# EAGLE design PCB_Design.sch (EAGLE 9.6.2)
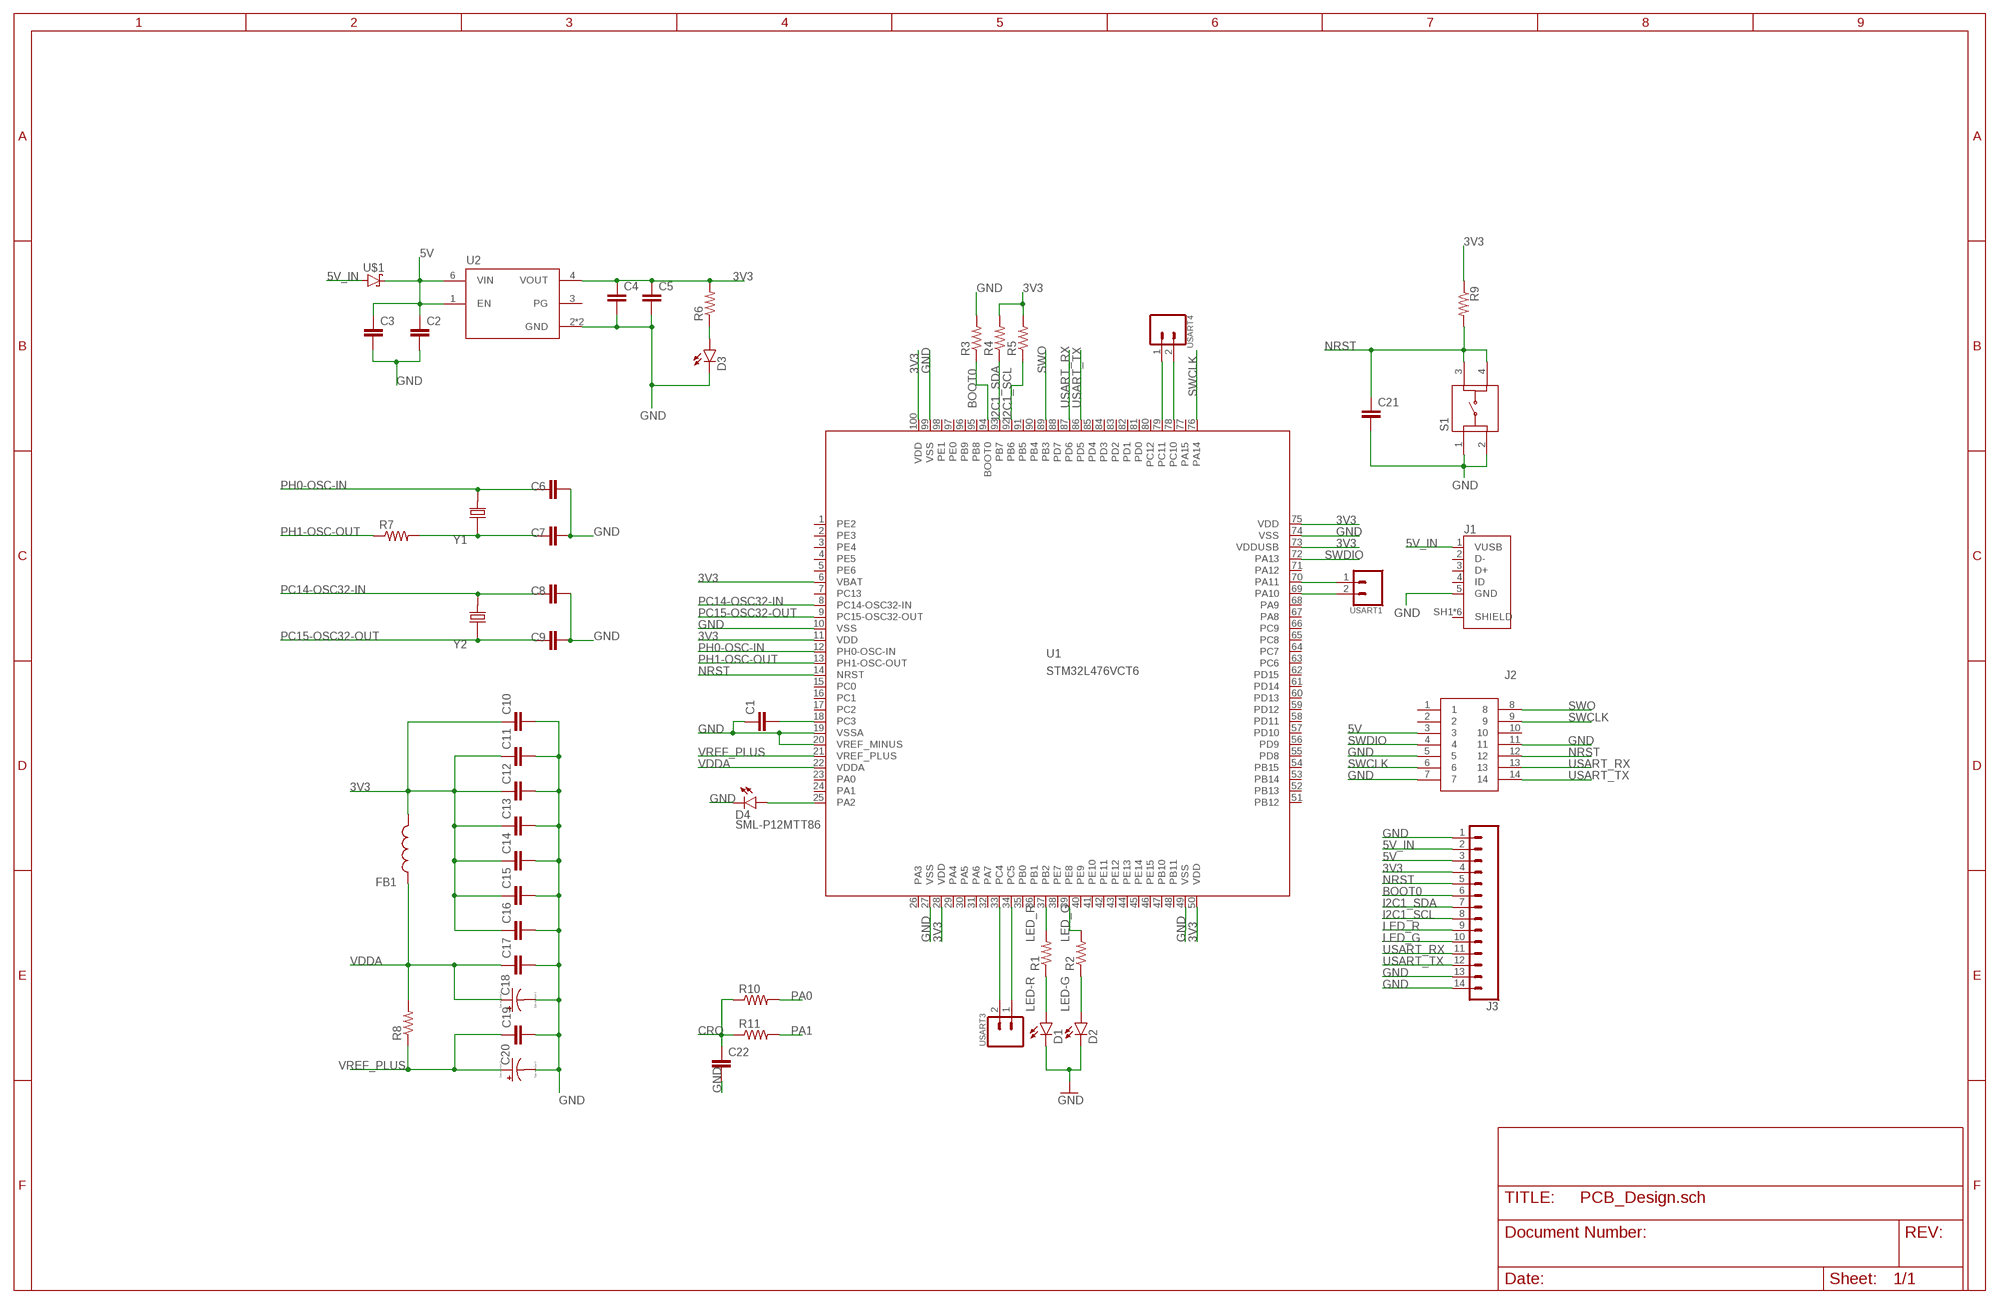
[diagram p0: schematic, sheet 1]

## Parts
C1  CC0603KRX5R7BB105  [CAPC1608X90]
C2  CC0603KRX5R7BB105  [CAPC1608X90]
C3  CC0603KRX5R7BB105  [CAPC1608X90]
C4  CC0603KRX5R7BB105  [CAPC1608X90]
C5  CC0603KRX5R7BB105  [CAPC1608X90]
C6  CC0402JRNPO9BN200  [CAPC1005X55N]
C7  CC0402JRNPO9BN200  [CAPC1005X55N]
C8  CC0402CRNPO9BN4R7  [CAPC1005X55N]
C9  CC0402CRNPO9BN4R7  [CAPC1005X55N]
C10  CC0603KRX5R7BB105  [CAPC1608X90]
C11  CC0402KRX7R7BB104  [CAPC1005X55N]
C12  CC0402KRX7R7BB104  [CAPC1005X55N]
C13  CC0402KRX7R7BB104  [CAPC1005X55N]
C14  CC0402KRX7R7BB104  [CAPC1005X55N]
C15  CC0402KRX7R7BB104  [CAPC1005X55N]
C16  CC0402KRX7R7BB104  [CAPC1005X55N]
C17  CC0402KRX7R7BB104  [CAPC1005X55N]
C18  TAJA105K016RNJ  [CAPPM3216X180N]
C19  CC0402KRX7R7BB104  [CAPC1005X55N]
C20  TAJA105K016RNJ  [CAPPM3216X180N]
C21  CC0402KRX7R7BB104  [CAPC1005X55N]
C22  CC0402KRX7R7BB104  [CAPC1005X55N]
D1  SML-P12MTT86  [LED_SML-P11UTT86R]
D2  SML-P12MTT86  [LED_SML-P11UTT86R]
D3  SML-P12VTT86  [LED_SML-P11UTT86R]
D4  SML-P12MTT86  [LED_SML-P11UTT86R]
FB1  BK1608HS601-T  [BEADC1608X95N]
J1  10118192-0001LF  [AMPHENOL_10118192-0001LF]
J2  FTSH-107-01-L-DV-K-A  [FTSH10701LDVKA]
J3  CONN_14  [1X14]
R1  RC0402FR-071KL  [RESC1005X40N]
R2  RC0402FR-071KL  [RESC1005X40N]
R3  RC0402FR-071KL  [RESC1005X40N]
R4  RC0402FR-071KL  [RESC1005X40N]
R5  RC0402FR-071KL  [RESC1005X40N]
R6  RC0402FR-071KL  [RESC1005X40N]
R7  RC0402FR-071KL  [RESC1005X40N]
R8  RC0402FR-071KL  [RESC1005X40N]
R9  RC0402FR-071KL  [RESC1005X40N]
R10  RC0402FR-0710KL  [RESC1005X40N]
R11  RC0402FR-07330RL  [RESC1005X40N]
S1  LL3301FF065QJ  [LL3301FF065QJ]
U1  STM32L476VCT6  [LQFP100_14X14]
U2  LD39050PU33R  [SON95P300X300X100-7N]
U$1  STPS1L30A  [DIOM5226X223N]
USART1  CONN_02LOCK  [1X02_LOCK]
USART3  CONN_02LOCK  [1X02_LOCK]
USART4  CONN_02LOCK  [1X02_LOCK]
Y1  ABLS-8.000MHZ-B2-T  [XTAL_ABLS-8.000MHZ-B2-T]
Y2  ECS-.327-12.5-12QS-TR  [XTAL_ECS-.327-12.5-12QS-TR]

## Nets
3V3: C4.1 C5.1 C10.1 C11.1 C12.1 C13.1 C14.1 C15.1 C16.1 FB1.2 J3.4 R4.2 R5.2 R6.2 R9.1 U1.6(VBAT) U1.11(VDD) U1.28(VDD) U1.50(VDD) U1.73(VDDUSB) U1.75(VDD) U1.100(VDD) U2.4(VOUT)
5V: C2.1 C3.1 J2.3 J3.3 U2.1(EN) U2.6(VIN) U$1.1(C)
5V_IN: J1.1(VUSB) J3.2 U$1.2(A)
BOOT0: J3.6 R3.1 U1.94(BOOT0)
CRO: C22.1 R10.1 R11.1
GND: C1.1 C2.2 C3.2 C4.2 C5.2 C6.2 C7.2 C8.2 C9.2 C10.2 C11.2 C12.2 C13.2 C14.2 C15.2 C16.2 C17.2 C18.C(-) C19.2 C20.C(-) C21.2 C22.2 D1.C D2.C D3.C D4.C J1.5(GND) J2.5 J2.7 J2.11 J3.1 J3.13 J3.14 R3.2 S1.1 S1.2 U1.10(VSS) U1.19(VSSA) U1.20(VREF_MINUS) U1.27(VSS) U1.49(VSS) U1.74(VSS) U1.99(VSS) U2.2(GND) U2.7(GND)
I2C1_SCL: J3.8 R5.1 U1.92(PB6)
I2C1_SDA: J3.7 R4.1 U1.93(PB7)
LED-G: D2.A R2.1
LED-R: D1.A R1.1
LED_G: J3.10 R2.2 U1.39(PE8)
LED_R: J3.9 R1.2 U1.37(PB2)
N$1: D4.A U1.25(PA2)
N$2: U1.33(PC4) USART3.2
N$3: U1.34(PC5) USART3.1
N$4: U1.78(PC10) USART4.2
N$5: U1.69(PA10) USART1.2
N$6: U1.79(PC11) USART4.1
N$7: U1.70(PA11) USART1.1
N$9: C7.1 R7.2 Y1.1
N$11: C1.2 U1.18(PC3)
N$14: D3.A R6.1
NRST: C21.1 J2.12 J3.5 R9.2 S1.3 S1.4 U1.14(NRST)
PA0: R10.2
PA1: R11.2
PC14-OSC32-IN: C8.1 U1.8(PC14-OSC32-IN) Y2.2
PC15-OSC32-OUT: C9.1 U1.9(PC15-OSC32-OUT) Y2.1
PH0-OSC-IN: C6.1 U1.12(PH0-OSC-IN) Y1.2
PH1-OSC-OUT: R7.1 U1.13(PH1-OSC-OUT)
SWCLK: J2.6 J2.9 U1.76(PA14)
SWDIO: J2.4 U1.72(PA13)
SWO: J2.8 U1.89(PB3)
USART_RX: J2.13 J3.11 U1.87(PD6)
USART_TX: J2.14 J3.12 U1.86(PD5)
VDDA: C17.1 C18.A(+) FB1.1 R8.2 U1.22(VDDA)
VREF_PLUS: C19.1 C20.A(+) R8.1 U1.21(VREF_PLUS)
Unconnected: J1.2(D-) J1.3(D+) J1.4(ID) J1.SH1(SHIELD) J1.SH2(SHIELD) J1.SH3(SHIELD) J1.SH4(SHIELD) J1.SH5(SHIELD) J1.SH6(SHIELD) J2.1 J2.2 J2.10 U1.1(PE2) U1.2(PE3) U1.3(PE4) U1.4(PE5) U1.5(PE6) U1.7(PC13) U1.15(PC0) U1.16(PC1) U1.17(PC2) U1.23(PA0) U1.24(PA1) U1.26(PA3) U1.29(PA4) U1.30(PA5) U1.31(PA6) U1.32(PA7) U1.35(PB0) U1.36(PB1) U1.38(PE7) U1.40(PE9) U1.41(PE10) U1.42(PE11) U1.43(PE12) U1.44(PE13) U1.45(PE14) U1.46(PE15) U1.47(PB10) U1.48(PB11) U1.51(PB12) U1.52(PB13) U1.53(PB14) U1.54(PB15) U1.55(PD8) U1.56(PD9) U1.57(PD10) U1.58(PD11) U1.59(PD12) U1.60(PD13) U1.61(PD14) U1.62(PD15) U1.63(PC6) U1.64(PC7) U1.65(PC8) U1.66(PC9) U1.67(PA8) U1.68(PA9) U1.71(PA12) U1.77(PA15) U1.80(PC12) U1.81(PD0) U1.82(PD1) U1.83(PD2) U1.84(PD3) U1.85(PD4) U1.88(PD7) U1.90(PB4) U1.91(PB5) U1.95(PB8) U1.96(PB9) U1.97(PE0) U1.98(PE1) U2.3(PG)

## Library data of the parts
C1-C5 C10 = ce-capstone:CC0603KRX5R7BB105: CAPACITOR CERAMIC, 1µF, 10V, X5R, 0603; Dielectric Characteristic:X5R; Capacitance:1µF; Capacitance Tolerance:± 10%; Voltage Rating:16V; Temperature Coefficient:± 15%; Capacitor Case Style:0603; No. of Pins:2; Mounting Type:SMD ;RoHS Compliant: Yes; DESCRIPTION: 1µF ±10% 16V Ceramic Capacitor X5R 0603 _1608 Metric_; DIGI-KEY_PART_NUMBER: 311-1444-1-ND; DIGI-KEY_PURCHASE_URL: https://www.digikey.com/product-detail/en/yageo/CC0603KRX5R7BB105/311-1444-1-ND/2833750?utm_source=snapeda&utm_medium=aggregator&utm_campaign=symbol; MF: Yageo; MP: CC0603KRX5R7BB105; PACKAGE: 0603 Yageo
C6 C7 = ce-capstone:CC0402JRNPO9BN200: CAPACITOR CERAMIC 20PF 50V, C0G, 0402; Dielectric Characteristic:C0G / NP0; Capacitance:20pF; Capacitance Tolerance:± 5%; Voltage Rating:50V; Capacitor Case Style:0402; Capacitor Mounting:SMD; DESCRIPTION: 20pF ±5% 50V Ceramic Capacitor C0G, NP0 0402 _1005 Metric_; DIGI-KEY_PART_NUMBER: 311-1417-1-ND; DIGI-KEY_PURCHASE_URL: https://www.digikey.com/product-detail/en/yageo/CC0402JRNPO9BN200/311-1417-1-ND/2833723?utm_source=snapeda&utm_medium=aggregator&utm_campaign=symbol; MF: Yageo; MP: CC0402JRNPO9BN200; PACKAGE: 0402 Yageo
C8 C9 = ce-capstone:CC0402CRNPO9BN4R7: 0402 4.7 pF 50 V ±0.25 pF Tolerance NP0 SMT Multilayer Ceramic Capacitor; DESCRIPTION: 4.7pF ±0.25pF 50V Ceramic Capacitor C0G, NP0 0402 _1005 Metric_; DIGI-KEY_PART_NUMBER: 311-1367-1-ND; DIGI-KEY_PURCHASE_URL: https://www.digikey.com/product-detail/en/yageo/CC0402CRNPO9BN4R7/311-1367-1-ND/2103151?utm_source=snapeda&utm_medium=aggregator&utm_campaign=symbol; MF: Yageo; MP: CC0402CRNPO9BN4R7; PACKAGE: 0402 Yageo
C11-C17 C19 C21 C22 = ce-capstone:CC0402KRX7R7BB104: .1UF 16V 10% 0402; DESCRIPTION: 0.1µF ±10% 16V Ceramic Capacitor X7R 0402 _1005 Metric_; DIGI-KEY_PART_NUMBER: 311-1338-1-ND; DIGI-KEY_PURCHASE_URL: https://www.digikey.com/product-detail/en/yageo/CC0402KRX7R7BB104/311-1338-1-ND/2103122?utm_source=snapeda&utm_medium=aggregator&utm_campaign=symbol; MF: Yageo; MP: CC0402KRX7R7BB104; PACKAGE: 0402 Yageo
C18 C20 = ce-capstone:TAJA105K016RNJ: Capacitor tantalum TAJ 1206 1uF 16V AVX 1uF SMD Solid MnO2 Tantalum Electrolytic Capacitor, 16 V dc +/-10%, TAJ Series Source: Datasheet; ALLIED_NUMBER: 70474975; ALLIED_PRICE-STOCK: https://www.alliedelec.com/avx-taja105k016r/70474975/; DESCRIPTION: Capacitor tantalum TAJ 1206 1uF 16V AVX 1uF SMD Solid MnO2 Tantalum Electrolytic Capacitor, 16 V dc +/-10%, TAJ Series; HEIGHT: 1.8mm; MANUFACTURER_NAME: AVX; MANUFACTURER_PART_NUMBER: TAJA105K016RNJ; MOUSER_PART_NUMBER: 581-TAJA105K016RNJ; MOUSER_PRICE-STOCK: https://www.mouser.com/Search/Refine.aspx?Keyword=581-TAJA105K016R; RS_PART_NUMBER: 6992804P; RS_PRICE-STOCK: http://uk.rs-online.com/web/p/products/6992804P
D1 D2 D4 = ce-capstone:SML-P12MTT86: SML-P1 Series Red 0402 Clear 60 mcd 2 V Surface Mount PICOLED LED; AVAILABILITY: Unavailable; DESCRIPTION: Green 572nm LED Indication - Discrete 2V 0402 _1006 Metric_; MF: Rohm; MP: SML-P12MTT86; PACKAGE: 0402 Rohm; PRICE: None
D3 = ce-capstone:SML-P12VTT86: SML-P1 Series Red 0402 Clear 60 mcd 2 V Surface Mount PICOLED LED; AVAILABILITY: Unavailable; DESCRIPTION: Red 630nm LED Indication - Discrete 2V 0402 _1006 Metric_; MF: Rohm; MP: SML-P12VTT86; PACKAGE: 0402 Rohm; PRICE: None
FB1 = ce-capstone:BK1608HS601-T: Ferrite Chip Bead(Lead Free) Source: Datasheet; DESCRIPTION: Ferrite Chip Bead(Lead Free); HEIGHT: 0.95mm; MANUFACTURER_NAME: Taiyo Yuden; MANUFACTURER_PART_NUMBER: BK1608HS601-T
J1 = ce-capstone:10118192-0001LF: Single Port 5 Contact Horizontal Right Angle Shielded Micro B USB 2.0 Connector; AVAILABILITY: Unavailable; DESCRIPTION: USB - micro B USB 2.0 Receptacle Connector 5 Position Surface Mount, Right Angle; MF: Amphenol ICC; MP: 10118192-0001LF; PACKAGE: None; PRICE: None
J2 = ce-capstone:FTSH-107-01-L-DV-K-A: Headers & Wire Housings .050" Micro Terminal Strip Source: Datasheet; DESCRIPTION: Headers & Wire Housings .050" Micro Terminal Strip; HEIGHT: 5.97mm; MANUFACTURER_NAME: SAMTEC; MANUFACTURER_PART_NUMBER: FTSH-107-01-L-DV-K-A; MOUSER_PART_NUMBER: 200-FTSH10701LDVKA; MOUSER_PRICE-STOCK: https://www.mouser.com/Search/Refine.aspx?Keyword=200-FTSH10701LDVKA
J3 = SparkFun-Connectors:CONN_14: Multi connection point. Often used as Generic Header-pin footprint for 0.1 inch spaced/style header connections On any of the 0.1 inch spaced packages, you can populate with these: Break Away Headers - Straight (PRT-00116) Break Away Male Headers - Right Angle (PRT-00553) Female Headers (PRT-00115) Break Away Headers - Machine Pin (PRT-00117) Break Away Female Headers - Swiss Machine Pin (PRT-00743) For SCREWTERMINALS and SPRING TERMINALS visit here: Screw Terimnals on SparkFun.com (5mm/3.5mm/2.54mm spacing) This device is also useful as a general connection point to wire up your design to another part of your project. Our various solder wires solder well into these plated through hole pads. Hook-Up Wire - Assortment (Stranded, 22 AWG) (PRT-11375) Hook-Up Wire - Assortment (Solid Core, 22 AWG) (PRT-11367) View the entire wire category on our website here Special notes: Molex polarized connector foot print use with SKU : PRT-08231 with associated crimp pins and housings. 1MM SMD Version SKU: PRT-10208 NOTES ON THE VARIANTS LOCK and LOCK_LONGPADS... This footprint was designed to help hold the alignment of a through-hole component (i.e. 6-pin header) while soldering it into place. You may notice that each hole has been shifted either up or down by 0.005 of an inch from it's more standard position (which is a perfectly straight line). This slight alteration caused the pins (the squares in the middle) to touch the edges of the holes. Because they are alternating, it causes a "brace" to hold the component in place. 0.005 has proven to be the perfect amount of "off-center" position when using our standard breakaway headers. Although looks a little odd when you look at the bare footprint, once you have a header in there, the alteration is very hard to notice. Also,if you push a header all the way into place, it is covered up entirely on the bottom side.
R1-R9 = ce-capstone:RC0402FR-071KL: RES SMD 1k OHM 1% 1/16W 0402; DESCRIPTION: 510 Ohms ±1% 0.063W, 1/16W Chip Resistor 0402 _1005 Metric_ Moisture Resistant Thick Film; DIGI-KEY_PART_NUMBER: 311-510LRCT-ND; DIGI-KEY_PURCHASE_URL: https://www.digikey.com/product-detail/en/yageo/RC0402FR-07510RL/311-510LRCT-ND/729579?utm_source=snapeda&utm_medium=aggregator&utm_campaign=symbol; MF: Yageo; MP: RC0402FR-07510RL; PACKAGE: 1005 Panasonic Electronic Components
R10 = ce-capstone:RC0402FR-0710KL: RES SMD 10k OHM 1% 1/16W 0402; DESCRIPTION: 510 Ohms ±1% 0.063W, 1/16W Chip Resistor 0402 _1005 Metric_ Moisture Resistant Thick Film; DIGI-KEY_PART_NUMBER: 311-510LRCT-ND; DIGI-KEY_PURCHASE_URL: https://www.digikey.com/product-detail/en/yageo/RC0402FR-07510RL/311-510LRCT-ND/729579?utm_source=snapeda&utm_medium=aggregator&utm_campaign=symbol; MF: Yageo; MP: RC0402FR-07510RL; PACKAGE: 1005 Panasonic Electronic Components
R11 = ce-capstone:RC0402FR-07330RL: RES SMD 330 OHM 1% 1/16W 0402; DESCRIPTION: 510 Ohms ±1% 0.063W, 1/16W Chip Resistor 0402 _1005 Metric_ Moisture Resistant Thick Film; DIGI-KEY_PART_NUMBER: 311-510LRCT-ND; DIGI-KEY_PURCHASE_URL: https://www.digikey.com/product-detail/en/yageo/RC0402FR-07510RL/311-510LRCT-ND/729579?utm_source=snapeda&utm_medium=aggregator&utm_campaign=symbol; MF: Yageo; MP: RC0402FR-07510RL; PACKAGE: 1005 Panasonic Electronic Components
S1 = ce-capstone:LL3301FF065QJ: Pushbutton Switches 50mA 12VDC F065 7.0mm J-Lead Source: Datasheet; DESCRIPTION: Pushbutton Switches 50mA 12VDC F065 7.0mm J-Lead; HEIGHT: 7.3mm; MANUFACTURER_NAME: E-Switch; MANUFACTURER_PART_NUMBER: LL3301FF065QJ; MOUSER_PART_NUMBER: 612-LL3301FF065QJ; MOUSER_PRICE-STOCK: https://www.mouser.com/Search/Refine.aspx?Keyword=612-LL3301FF065QJ
U1 = ce-capstone:STM32L476V*: STM32L476VX LQFP100 Datasheet STM32L476XX; FARNELL: 2518171; FLASH: 256kB; SRAM: 128kB
U2 = ce-capstone:LD39050PU33R: LD39050 Series 500 mA 3.3 V Fixed Low Noise LDO Voltage Regulator - DFN-6; AVAILABILITY: Unavailable; DESCRIPTION: Linear Voltage Regulator IC 1 Output 500mA 6-DFN _3x3_; MF: STMicroelectronics; MP: LD39050PU33R; PACKAGE: DFN-6 STMicroelectronics; PRICE: None
U$1 = ce-capstone:STPS1L30A
USART1 USART3 USART4 = SparkFun-Connectors:CONN_02: Multi connection point. Often used as Generic Header-pin footprint for 0.1 inch spaced/style header connections On any of the 0.1 inch spaced packages, you can populate with these: Break Away Headers - Straight (PRT-00116) Break Away Male Headers - Right Angle (PRT-00553) Female Headers (PRT-00115) Break Away Headers - Machine Pin (PRT-00117) Break Away Female Headers - Swiss Machine Pin (PRT-00743) For SCREWTERMINALS and SPRING TERMINALS visit here: Screw Terimnals on SparkFun.com (5mm/3.5mm/2.54mm spacing) This device is also useful as a general connection point to wire up your design to another part of your project. Our various solder wires solder well into these plated through hole pads. Hook-Up Wire - Assortment (Stranded, 22 AWG) (PRT-11375) Hook-Up Wire - Assortment (Solid Core, 22 AWG) (PRT-11367) View the entire wire category on our website here Special notes: Molex polarized connector foot print use with: PRT-08233 with associated crimp pins and housings. 2.54_SCREWTERM for use with PRT-10571. 3.5mm Screw Terminal footprints for PRT-08084 5mm Screw Terminal footprints for use with PRT-08432
Y1 = ce-capstone:ABLS-8.000MHZ-B2-T: Crystal 8MHz Â±20ppm (Tol) Â±50ppm (Stability) 18pF FUND 80Ohm 2-Pin HC-49/US SMD T/R; AVAILABILITY: Unavailable; DESCRIPTION: 8MHz ±20ppm Crystal 18pF 80 Ohms HC-49/US; MF: Abracon LLC; MP: ABLS-8.000MHZ-B2; PACKAGE: HC-49/US Abracon LLC; PRICE: None
Y2 = ce-capstone:ECS-.327-12.5-12QS-TR: SMD CRYSTAL 32.768 KHz; AVAILABILITY: Unavailable; DESCRIPTION: 32.768kHz ±20ppm Crystal 12.5pF 90 kOhms 2-SMD, No Lead; MF: ECS Inc.; MP: ECS-.327-12.5-12QS-TR; PACKAGE: SMD-2 ECS International; PRICE: None

## Board
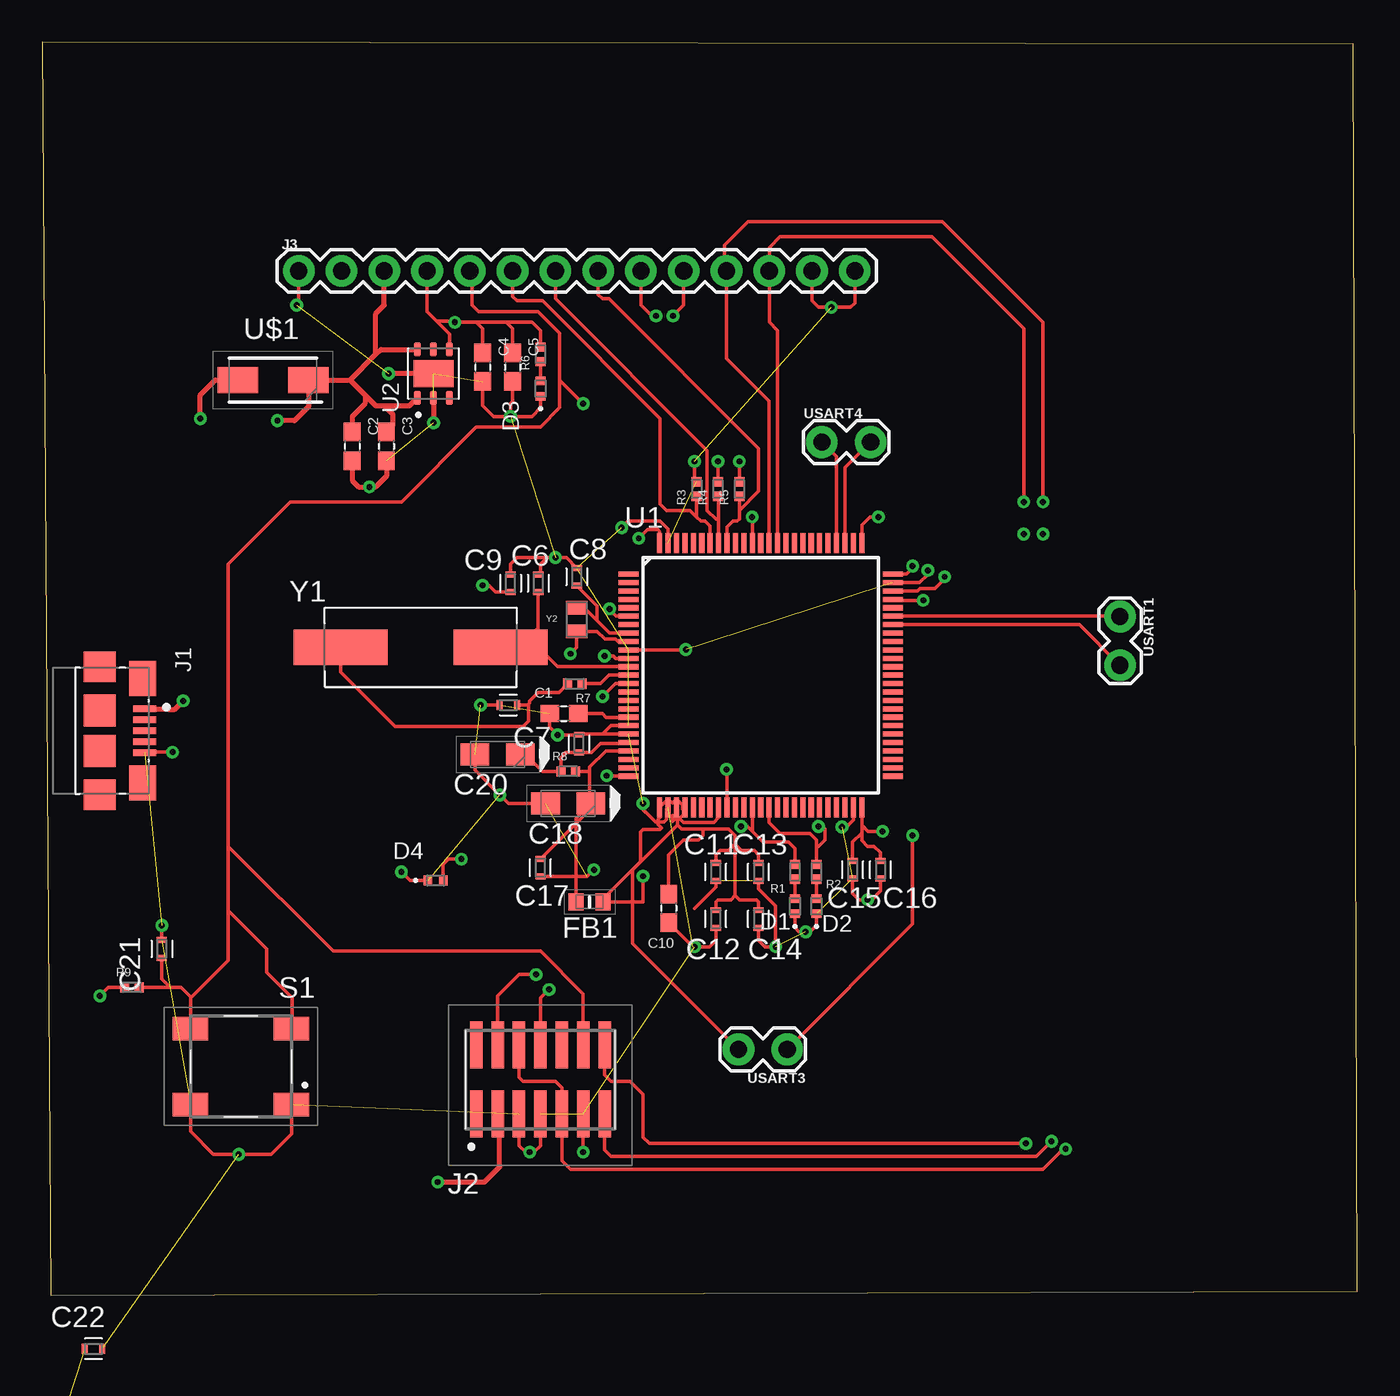
[diagram p1: board, top side]
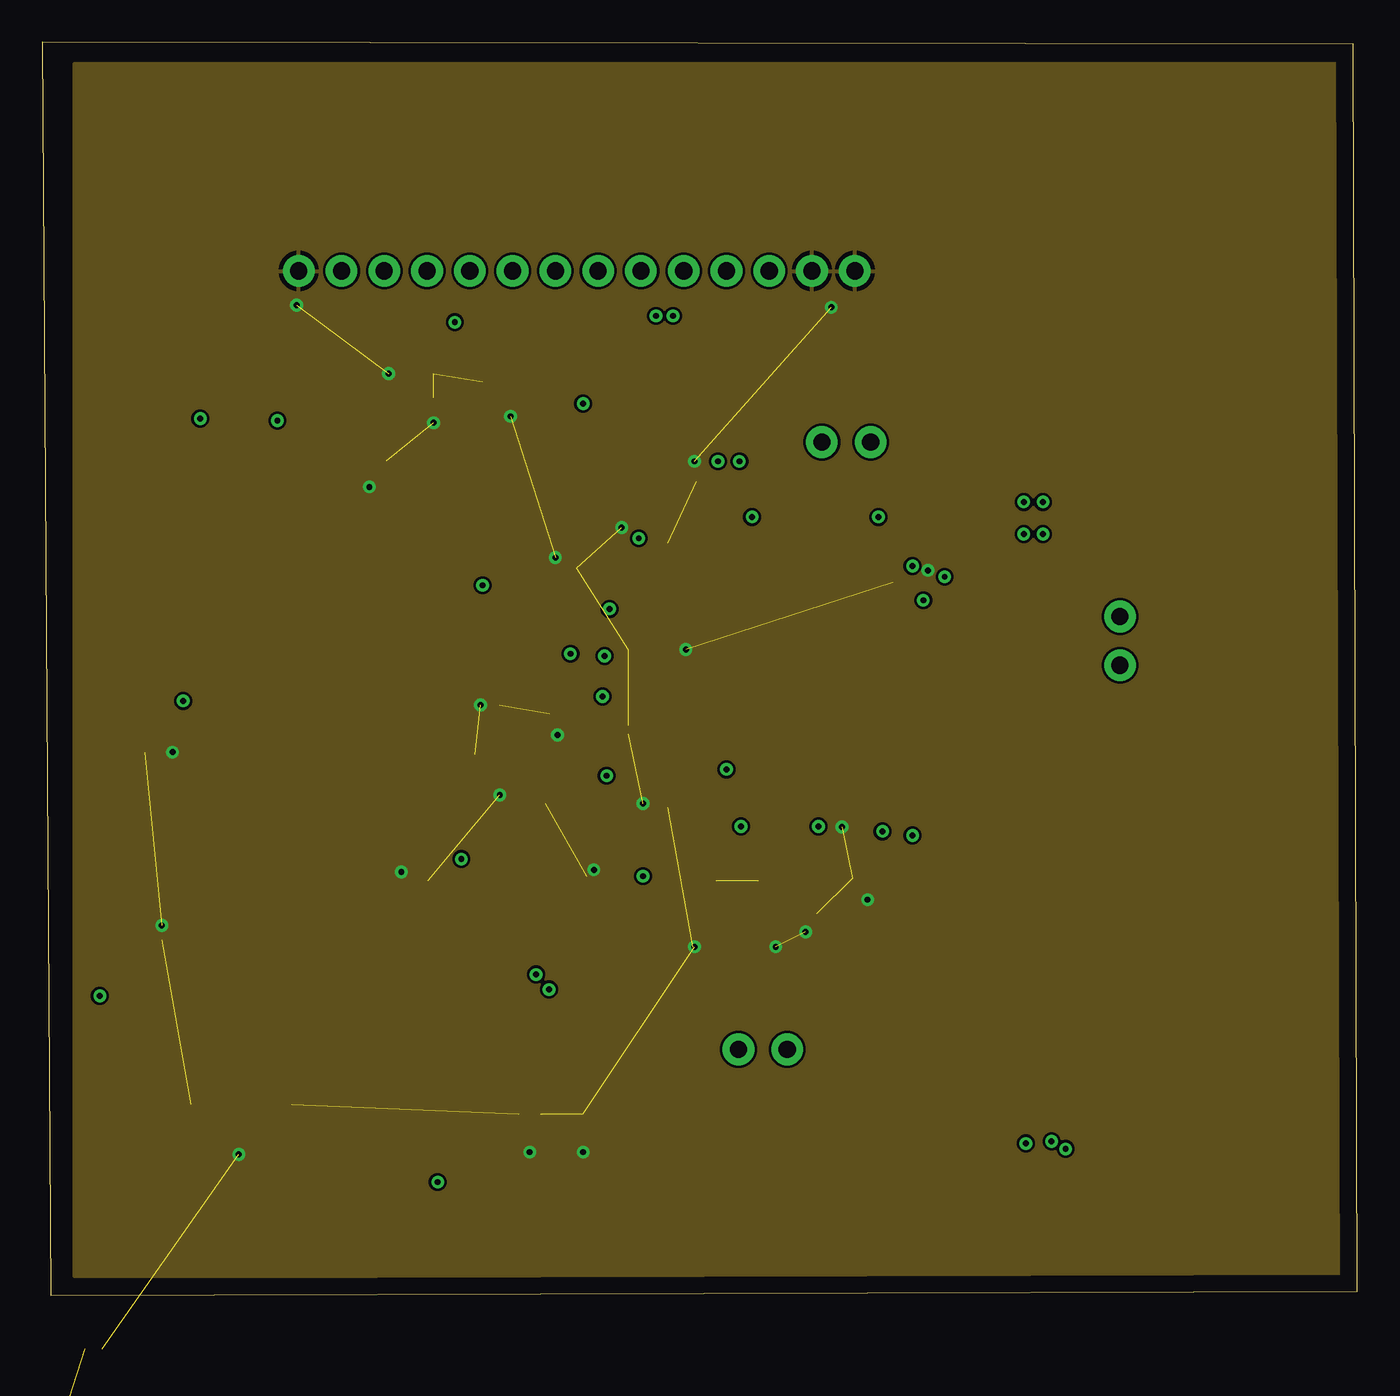
[diagram p2: board, inner layer Route2]
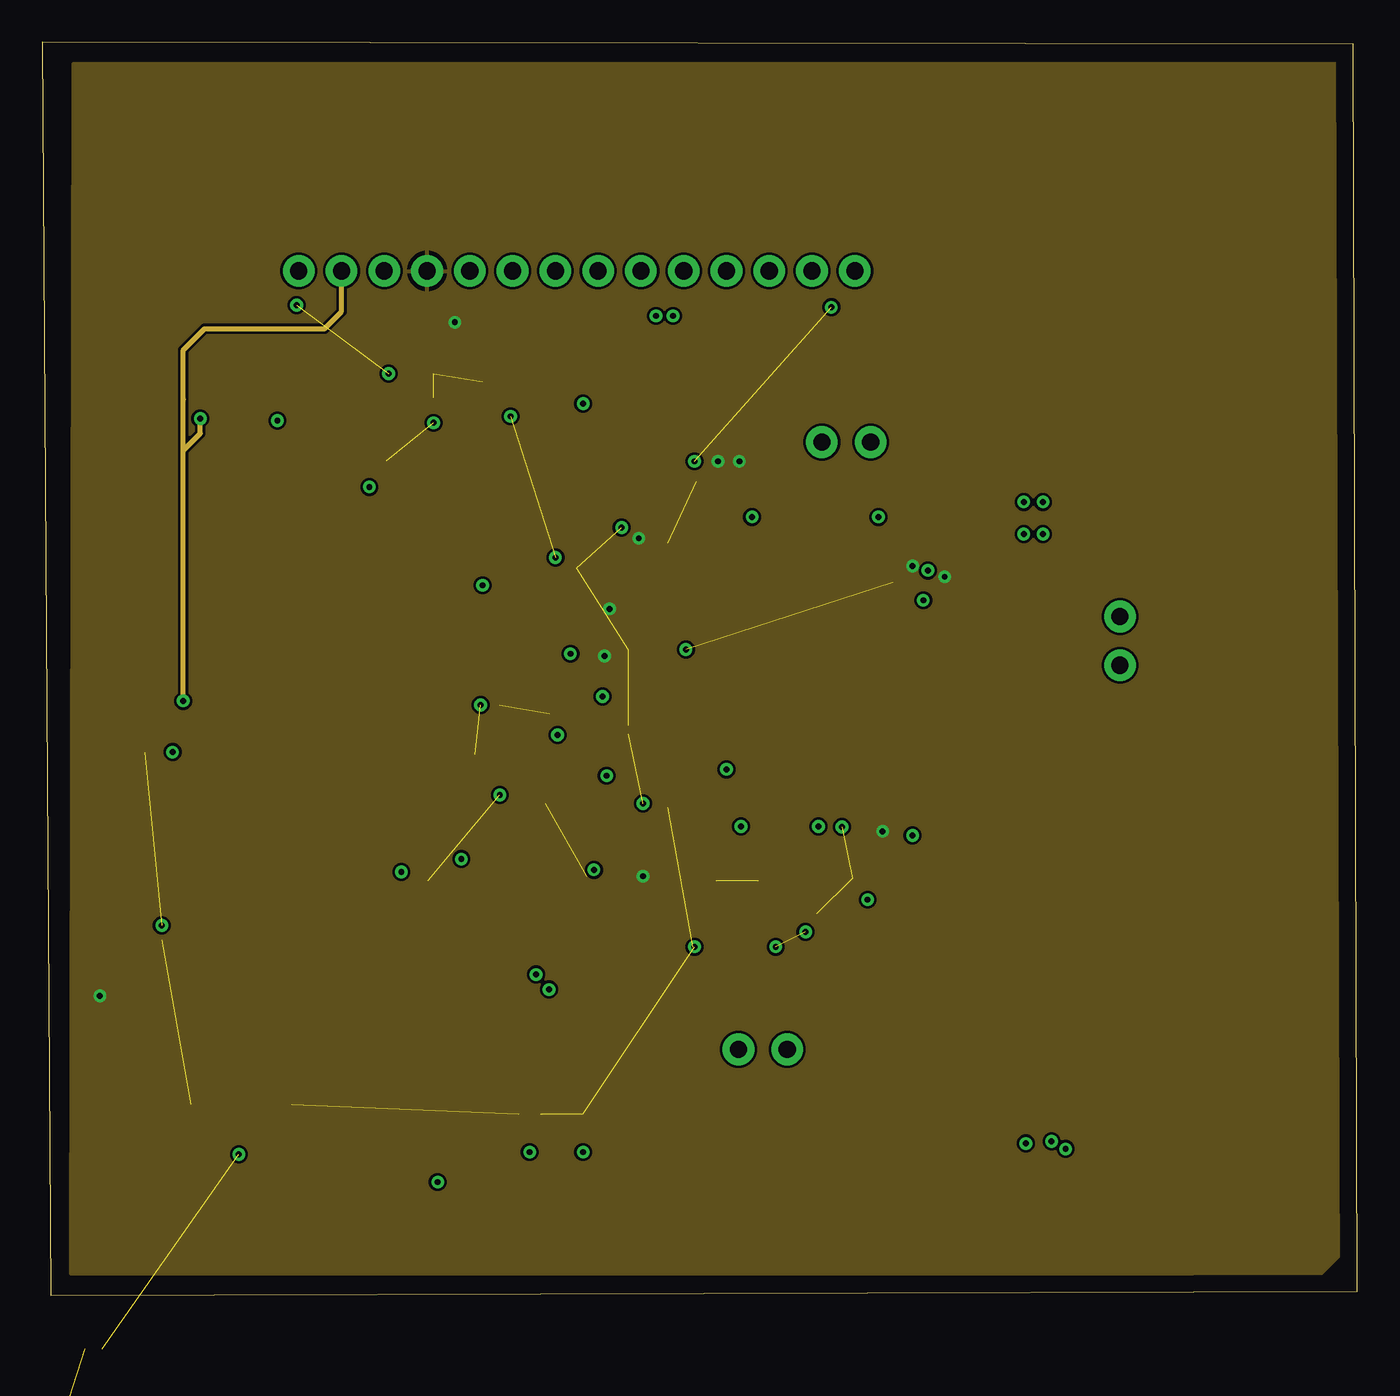
[diagram p3: board, inner layer Route15]
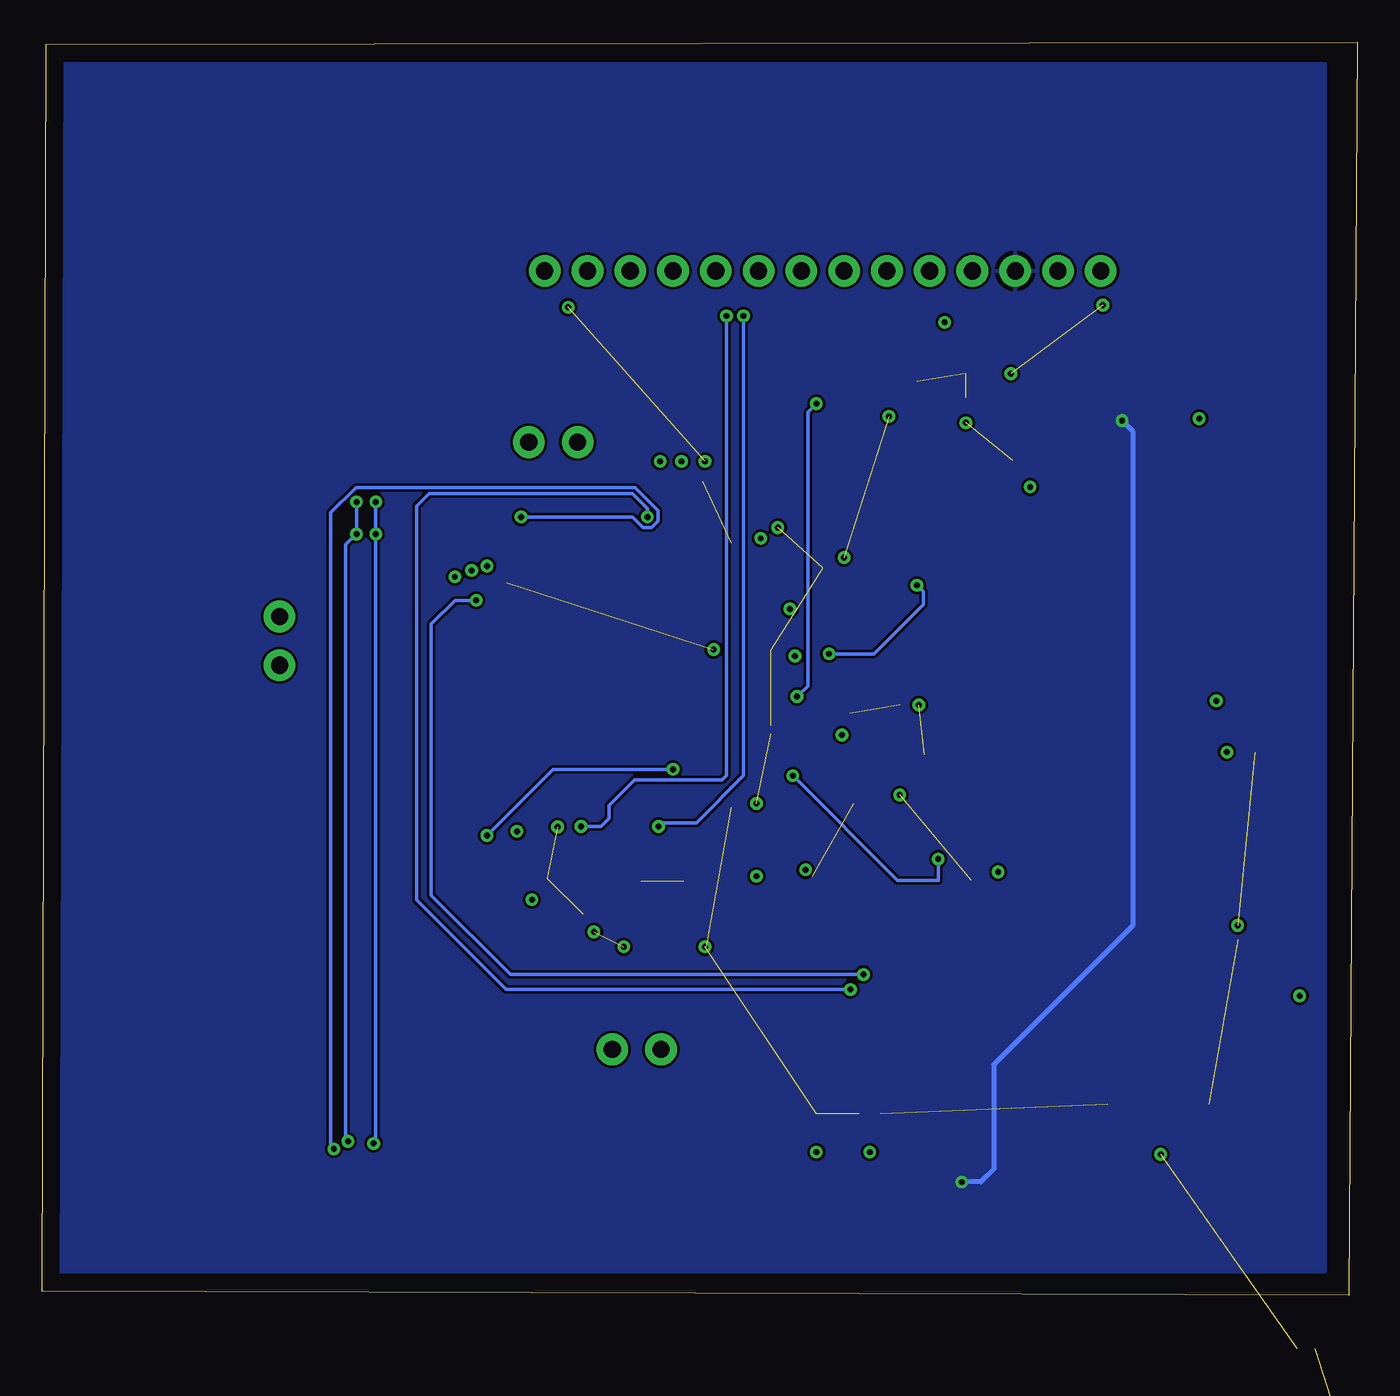
[diagram p4: board, bottom side, seen from below]

Size 78.11 x 74.42 mm. Coordinates in mm from the lower left corner, seen from the top.
Outline: 0.51,0 78.11,0.25 77.85,74.29 0,74.42 0.51,0
Copper layers (1+2*15+16): Top 0.035mm / dielectric 1.5mm / Route2 0.035mm / dielectric 0.15mm / Route15 0.035mm / dielectric 0.2mm / Bottom 0.035mm
Design rules "default *": minimum track width 8mil, minimum drill 0.35mm, track to track 6mil, track to pad 6mil, pad to pad 6mil, via to via 6mil, smd to smd 6mil, copper to edge 40mil, drill to drill 6mil, minimum pad ring 10mil, minimum via ring 8mil, stop-mask expansion 4mil, vias tented up to drill 0mil, thermal gap 10mil

### Footprints (pad centres in the part's own frame; a part is rotated, then mirrored left to right if it is on the bottom)
CAPC1608X90 = smd 1.1 x 1: 1 -0.85,0; 2 0.85,0
CAPC1005X55N = smd 0.35 x 0.6: 1 -0.525,0; 2 0.525,0
CAPPM3216X180N = smd 1.7 x 1.3: A -1.35,0; C 1.35,0
LED_SML-P11UTT86R = smd 0.5 x 0.6: A 0.45,0; C -0.45,0
BEADC1608X95N = smd 0.9 x 1: 1 -0.8,0; 2 0.8,0
AMPHENOL_10118192-0001LF = smd 0.4 x 1.35: 1 -1.3,0; 2 -0.65,0; 3 0,0; 4 0.65,0; 5 1.3,0 | smd 2.1 x 1.6: SH1 -3.1,-0.125; SH2 3.1,-0.125 | smd 1.8 x 1.9: SH3 -3.8,-2.675; SH6 3.8,-2.675 | smd 1.9 x 1.9: SH4 -1.2,-2.675; SH5 1.2,-2.675
FTSH10701LDVKA = smd 0.74 x 2.79: 1 -3.81,-2.035; 2 -3.81,2.035; 3 -2.54,-2.035; 4 -2.54,2.035; 5 -1.27,-2.035; 6 -1.27,2.035; 7 0,-2.035; 8 0,2.035; 9 1.27,-2.035; 10 1.27,2.035; 11 2.54,-2.035; 12 2.54,2.035; 13 3.81,-2.035; 14 3.81,2.035
1X14 = drill 1.016 pad 1.88: 1 0,0; 2 2.54,0; 3 5.08,0; 4 7.62,0; 5 10.16,0; 6 12.7,0; 7 15.24,0; 8 17.78,0; 9 20.32,0; 10 22.86,0; 11 25.4,0; 12 27.94,0; 13 30.48,0; 14 33.02,0
RESC1005X40N = smd 0.54 x 0.6: 1 -0.432,0; 2 0.432,0
LL3301FF065QJ = smd 2.1 x 1.4: 1 -3,2.25; 2 3,2.25; 3 -3,-2.25; 4 3,-2.25
LQFP100_14X14 = smd 1.2 x 0.3: 1 -7.85,6; 2 -7.85,5.5; 3 -7.85,5; 4 -7.85,4.5; 5 -7.85,4; 6 -7.85,3.5; 7 -7.85,3; 8 -7.85,2.5; 9 -7.85,2; 10 -7.85,1.5; 11 -7.85,1; 12 -7.85,0.5; 13 -7.85,0; 14 -7.85,-0.5; 15 -7.85,-1; 16 -7.85,-1.5; 17 -7.85,-2; 18 -7.85,-2.5; 19 -7.85,-3; 20 -7.85,-3.5; 21 -7.85,-4; 22 -7.85,-4.5; 23 -7.85,-5; 24 -7.85,-5.5; 25 -7.85,-6; 51 7.85,-6; 52 7.85,-5.5; 53 7.85,-5; 54 7.85,-4.5; 55 7.85,-4; 56 7.85,-3.5; 57 7.85,-3; 58 7.85,-2.5; 59 7.85,-2; 60 7.85,-1.5; 61 7.85,-1; 62 7.85,-0.5; 63 7.85,0; 64 7.85,0.5; 65 7.85,1; 66 7.85,1.5; 67 7.85,2; 68 7.85,2.5; 69 7.85,3; 70 7.85,3.5; 71 7.85,4; 72 7.85,4.5; 73 7.85,5; 74 7.85,5.5; 75 7.85,6 | smd 0.3 x 1.2: 26 -6,-7.85; 27 -5.5,-7.85; 28 -5,-7.85; 29 -4.5,-7.85; 30 -4,-7.85; 31 -3.5,-7.85; 32 -3,-7.85; 33 -2.5,-7.85; 34 -2,-7.85; 35 -1.5,-7.85; 36 -1,-7.85; 37 -0.5,-7.85; 38 0,-7.85; 39 0.5,-7.85; 40 1,-7.85; 41 1.5,-7.85; 42 2,-7.85; 43 2.5,-7.85; 44 3,-7.85; 45 3.5,-7.85; 46 4,-7.85; 47 4.5,-7.85; 48 5,-7.85; 49 5.5,-7.85; 50 6,-7.85; 76 6,7.85; 77 5.5,7.85; 78 5,7.85; 79 4.5,7.85; 80 4,7.85; 81 3.5,7.85; 82 3,7.85; 83 2.5,7.85; 84 2,7.85; 85 1.5,7.85; 86 1,7.85; 87 0.5,7.85; 88 0,7.85; 89 -0.5,7.85; 90 -1,7.85; 91 -1.5,7.85; 92 -2,7.85; 93 -2.5,7.85; 94 -3,7.85; 95 -3.5,7.85; 96 -4,7.85; 97 -4.5,7.85; 98 -5,7.85; 99 -5.5,7.85; 100 -6,7.85
SON95P300X300X100-7N = smd 0.84 x 0.4: 1 -1.435,0.95; 2 -1.435,0; 3 -1.435,-0.95; 4 1.435,-0.95; 5 1.435,0; 6 1.435,0.95 | smd 1.625 x 2.365: 7 0,0
DIOM5226X223N = smd 2.4 x 1.55: 1 -2.1,0; 2 2.1,0
1X02_LOCK = drill 1.016 pad 1.88: 1 -0.178,0; 2 2.718,0
XTAL_ABLS-8.000MHZ-B2-T = smd 5.6 x 2.1: 1 -4.75,0; 2 4.75,0
XTAL_ECS-.327-12.5-12QS-TR = smd 0.8 x 1.3: 1 -0.7,0; 2 0.7,0

### Placement (x,y rotation side)
C1  30.99,34.54 0 top
C2  18.42,50.42 270 top
C3  20.45,50.42 270 top
C4  26.16,55.12 270 top
C5  27.94,55.12 270 top
C6  29.46,42.29 90 top
C7  27.69,35.05 180 top
C8  31.75,42.67 90 top
C9  27.81,42.29 90 top
C10  37.21,22.99 270 top
C11  40,25.15 270 top
C12  40,22.35 270 top
C13  42.54,25.15 270 top
C14  42.54,22.35 270 top
C15  48.13,25.27 270 top
C16  49.78,25.27 270 top
C17  29.59,25.4 270 top
C18  31.24,29.21 180 top
C19  31.88,32.77 90 top
C20  27.05,32.13 180 top
C21  7.11,20.57 90 top
C22  3.05,-3.17 0 top  (outside the outline)
D1  44.7,23.11 90 top
D2  45.97,23.11 90 top
D3  29.59,53.85 90 top
D4  23.37,24.64 0 top
FB1  32.51,23.37 0 top
J1  6.1,33.53 270 top
J2  29.59,12.83 0 top
J3  15.24,60.83 0 top
R1  44.7,25.15 90 top
R2  45.97,25.15 90 top
R3  38.86,47.88 90 top
R4  40.13,47.88 90 top
R5  41.4,47.88 90 top
R6  29.59,55.88 90 top
R7  31.62,36.32 180 top
R8  31.24,31.11 0 top
R9  5.33,18.29 0 top
R10  1.52,-7.62 0 top  (outside the outline)
R11  1.52,-10.29 0 top  (outside the outline)
S1  11.81,13.59 180 top
U1  42.67,36.83 0 top
U2  23.24,54.74 90 top
U$1  13.72,54.36 180 top
USART1  64.01,40.13 270 top
USART3  44.07,14.61 180 top
USART4  46.48,50.67 0 top
Y1  22.48,38.48 0 top
Y2  31.75,40.13 90 top

### Tracks (layer width: path | path; a pad name or v marks a point on that pad's centre or on a via)
3V3  (via drill 0.35)
  Top 0.203: 37.72,27.94 37.72,28.7 37.67,28.75 U1.28 | 37.72,27.94 33.31,23.53 FB1.2 35.69,23.37 v35.69,24.89 | U1.50 48.67,27.94 | 48.67,27.94 48.67,27.46 | 48.67,27.46 48.13,26.92 C15.1 | 48.67,27.46 48.67,27.02 49.02,26.67 49.4,26.67 49.78,26.29 C16.1 | 37.72,27.94 37.97,27.69 39.24,27.69 | 41.15,26.8 41.15,27.3 40.77,27.69 39.24,27.69 | 41.15,26.8 40.77,26.42 40.26,26.42 40,26.16 C11.1 | 41.15,26.8 41.53,26.42 42.29,26.42 42.54,26.16 C13.1 | 41.15,26.8 41.15,23.75 | 41.15,23.75 40.89,23.5 40.13,23.5 40,23.37 C12.1 | 41.15,23.75 41.4,23.5 42.42,23.5 42.54,23.37 C14.1 | C10.1 37.21,26.16 38.1,27.05 38.99,27.05 39.24,27.3 39.24,27.69 | R4.2 v40.13,49.53 | R5.2 v41.4,49.53 | 48.67,27.94 49.05,27.56 v49.91,27.56 | J3.4 22.86,58.42 23.43,57.85 | U2.4 24.19,57.09 23.43,57.85 | 23.43,57.85 24.45,57.85 v24.51,57.78 25.78,57.78 | C4.1 26.16,57.4 25.78,57.78 | C5.1 27.94,57.4 27.56,57.78 | 27.56,57.78 25.78,57.78 | R6.2 29.59,57.28 29.08,57.78 27.56,57.78 | R9.1 3.94,18.29 v3.43,17.78 | U1.75 51.34,42.83 51.69,43.18 v51.69,43.31 | U1.73 51.98,41.83 52.13,41.97 53.02,41.97 53.59,42.55 v53.59,42.67 | U1.6 34.09,40.33 33.69,40.73 v33.69,40.77 | U1.11 34.05,37.83 33.92,37.96 v33.4,37.96 | U1.100 36.67,45.37 36.58,45.47 35.94,45.47 v35.43,44.96
  pour Route15: 1.7,1.27 75.95,1.27 77.34,2.67 77.34,73.15 1.86,73.15
5V  (via drill 0.35)
  Top 0.305: 18.29,54.36 U$1.1 15.82,52.77 14.99,51.94 v13.97,51.94 | J3.3 20.32,58.8 19.81,58.29 19.81,55.88 | 18.29,54.36 19.81,55.88 | 19.81,55.88 20.1,56.17 U2.6 | 18.29,54.36 19.18,53.47 | 19.18,53.47 19.18,52.96 18.42,52.2 C2.1 | 19.18,53.47 19.81,52.83 20.32,52.83 | U2.1 21.82,52.83 20.32,52.83 | 20.32,52.83 20.83,52.32 20.83,51.65 C3.1 | v23.5,6.73 26.29,6.73 27.18,7.62 27.18,10.66 J2.3
  Bottom 0.305: v13.97,51.94 13.33,51.31 13.33,21.97 21.59,13.72 21.59,7.49 22.35,6.73 v23.5,6.73
  pour Bottom: 1.91,73.15 1.91,1.4 77.09,1.4 77.09,73.15
5V_IN  (via drill 0.35)
  Top 0.305: J1.1 7.46,34.83 7.49,34.8 7.87,34.8 v8.38,35.31 | v9.4,52.07 9.4,53.47 10.29,54.36 U$1.2
  Route15 0.305: v8.38,35.31 8.38,50.16 | 8.38,50.16 8.38,53.21 8.38,56.13 9.65,57.4 16.76,57.4 17.78,58.42 J3.2 | 8.38,50.16 9.4,51.18 v9.4,52.07
BOOT0
  Top 0.203: U1.94 39.67,45.67 39.37,45.97 39.12,45.97 38.86,46.23 | 38.86,46.23 R3.1 | 38.86,46.23 38.48,46.61 37.08,46.61 36.7,46.99 36.7,52.07 29.72,59.05 28.19,59.05 27.94,59.31 J3.6
CRO  (2 unrouted)
GND  (via drill 0.35)  (27 unrouted)
  Top 0.203: J1.5 6.13,32.26 v7.75,32.26 | U1.20 33.27,33.33 | 33.27,33.33 31.92,33.33 C19.2 31.88,33.27 v30.61,33.27 30.14,33.74 C1.1 | U1.19 33.77,33.83 33.27,33.33 | C20.C 25.7,31.2 v27.18,29.72 27.69,29.21 C18.C | v32.77,25.27 32.37,24.88 C17.2 | C13.2 42.54,24.13 43.56,23.11 v43.56,20.7 42.93,20.7 42.54,21.08 C14.2 | C11.2 40,24.26 38.73,22.99 | C15.2 48.13,23.88 48.51,23.5 v49.02,23.5 49.28,23.5 49.78,24 C16.2 | U1.49 48.17,28.23 47.75,27.81 v47.5,27.81 | C10.2 38.65,20.7 v38.73,20.7 39.62,20.7 40,21.08 C12.2 | D1.C 44.7,21.84 44.96,21.59 v45.34,21.59 45.59,21.59 45.97,21.97 D2.C | C7.2 v26.04,35.05 | C8.2 31.13,43.81 v30.48,43.81 29.97,43.81 | C6.2 29.59,42.94 29.59,43.43 29.97,43.81 | C9.2 27.81,43.43 28.19,43.81 29.97,43.81 | D3.C 29.59,52.7 29.08,52.2 v27.81,52.2 | C5.2 27.94,53.09 27.81,52.96 v27.81,52.2 | C4.2 26.16,52.83 26.8,52.2 v27.81,52.2 | S1.2 8.81,9.73 10.16,8.38 v11.68,8.38 13.59,8.38 14.81,9.6 S1.1 | C21.2 v7.11,21.97 | J2.5 28.32,8.89 28.7,8.51 v28.96,8.51 29.21,8.51 29.59,8.89 J2.7 | J2.11 v32.13,8.51 | J3.13 45.72,59.05 46.1,58.67 v46.86,58.67 48.01,58.67 48.26,58.93 J3.14 | U1.74 52.11,42.33 52.6,42.82 v52.6,43.05 | v15.11,58.8 15.24,58.93 J3.1 | U1.10 37.95,38.33 37.97,38.35 v38.23,38.35 | U1.99 37.17,45.51 36.7,45.97 34.8,45.97 v34.42,45.59 | U1.27 37.08,28.88 37.08,28.27 36.93,28.13 36.42,28.13 35.84,28.7 35.81,28.7 35.69,28.83 v35.69,29.21 | R3.2 38.73,48.44 v38.73,49.53 | D4.C 21.84,24.64 v21.34,25.15
  Top 0.305: C2.2 18.42,48.39 18.8,48.01 v19.43,48.01 19.81,48.01 20.45,48.64 C3.2 | U2.2 v23.24,51.82 | U2.7 v20.57,54.74
  pour Route2: 1.91,73.15 1.91,1.14 77.09,1.14 77.09,73.15
I2C1_SCL
  Top 0.203: U1.92 40.67,45.62 41.02,45.97 41.27,45.97 41.4,46.1 41.4,46.48 41.4,46.61 | 41.4,46.61 R5.1 | 41.4,46.61 42.54,47.75 42.54,50.29 33.66,59.18 33.27,59.18 33.02,59.44 J3.8
I2C1_SDA
  Top 0.203: U1.93 40.17,46.1 | 40.17,46.1 40.17,47.41 R4.1 | J3.7 30.48,59.18 39.5,50.16 39.5,46.61 40,46.1 40.17,46.1
LED-G
  Top 0.203: D2.A R2.1
LED-R
  Top 0.203: R1.1 D1.A
LED_G  (via drill 0.35)
  Top 0.203: U1.39 43.17,28.07 43.81,27.43 45.59,27.43 45.97,27.05 45.97,26.67 | 45.97,26.67 R2.2 | J3.10 38.1,58.8 v37.46,58.17 | v46.1,27.85 46.32,27.85 46.48,27.69 46.48,27.05 46.1,26.67 45.97,26.67
  Bottom 0.203: v37.46,58.17 37.46,30.86 37.72,30.61 42.93,30.61 44.45,29.08 44.45,28.32 44.92,27.85 v46.1,27.85
LED_R  (via drill 0.35)
  Top 0.203: U1.37 42.17,27.55 | R1.2 44.7,26.54 44.32,26.92 42.8,26.92 42.17,27.55 | J3.9 35.56,58.8 36.2,58.17 v36.45,58.17 | v41.5,27.85 41.87,27.85 42.17,27.55
  Bottom 0.203: v36.45,58.17 36.45,30.86 39.24,28.07 41.28,28.07 v41.5,27.85
N$1  (via drill 0.35)
  Top 0.203: U1.25 33.56,30.83 v33.53,30.86 | v24.89,25.91 24.13,25.91 23.82,25.6 D4.A
  Bottom 0.203: v33.53,30.86 27.3,24.64 24.89,24.64 v24.89,25.91
N$2
  Top 0.203: U1.33 40.17,28.37 39.89,28.09 38.07,28.09 37.87,28.3 37.57,28.3 37.43,28.16 37.43,28.49 37.57,28.35 37.87,28.35 38.07,28.55 38.07,28.85 38.03,28.9 38.03,29.13 37.82,29.34 37.52,29.34 37.42,29.23 37.32,29.34 37.02,29.34 36.72,29.03 36.72,28.42 36.57,28.27 36.57,27.98 36.78,27.77 36.69,27.68 35.68,27.68 35.53,27.53 35.53,25.75 35.05,25.27 35.05,20.9 USART3.2
N$3  (via drill 0.35)
  Top 0.203: U1.34 40.67,31.21 v40.64,31.24 | v51.69,27.3 51.69,22.05 USART3.1
  Bottom 0.203: v40.64,31.24 47.75,31.24 v51.69,27.3
N$4
  Top 0.203: U1.78 47.67,49.15 USART4.2
N$5
  Top 0.203: U1.69 61.59,39.83 USART1.2
N$6
  Top 0.203: U1.79 47.17,49.8 USART4.1
N$7
  Top 0.203: U1.70 63.99,40.33 USART1.1
N$9
  Top 0.203: R7.2 30.68,35.81 29.46,35.81 28.96,35.31 28.96,35.18 28.89,35.12 | 28.89,35.12 28.83,35.05 C7.1 | 28.89,35.12 28.89,34.1 28.58,33.78 20.96,33.78 17.73,37.01 Y1.1
N$11
  Top 0.203: U1.18 33.49,34.33 33.27,34.54 C1.2
N$14
  Top 0.203: R6.1 D3.A
NRST  (via drill 0.35)
  Top 0.203: S1.4 8.81,17.65 | 8.81,17.65 8.81,17.73 8.25,18.29 7.62,18.29 | 7.62,18.29 R9.2 | 7.62,18.29 7.11,18.8 C21.1 | S1.3 14.86,15.89 14.86,17.65 13.33,19.18 13.33,20.57 11.05,22.86 | 8.81,17.65 11.05,19.89 11.05,22.86 | 11.05,22.86 11.05,26.67 | 11.05,26.67 11.05,43.43 14.73,47.12 21.34,47.12 25.78,51.56 29.59,51.56 30.73,52.7 30.73,54.36 | 30.73,54.36 30.73,57.15 29.46,58.42 25.91,58.42 25.53,58.8 25.53,60.71 J3.5 | J2.12 32.13,17.91 29.59,20.45 17.27,20.45 11.05,26.67 | U1.14 34.04,36.33 v33.27,35.56 | v32.13,52.96 30.73,54.36
  Bottom 0.203: v33.27,35.56 32.64,36.2 32.64,52.45 v32.13,52.96
PC14-OSC32-IN
  Top 0.203: U1.8 33.7,39.33 32.96,40.07 | Y2.2 32.19,40.83 32.96,40.07 | 32.96,40.07 32.96,40.94 C8.1
PC15-OSC32-OUT  (via drill 0.35)
  Top 0.203: C9.1 26.94,41.77 26.54,42.16 v26.16,42.16 | v31.37,38.1 31.75,38.48 Y2.1 32.96,39.43 33.42,38.97 34.05,38.97 34.2,38.83 U1.9
  Bottom 0.203: v26.16,42.16 25.78,41.78 25.78,41.02 28.7,38.1 v31.37,38.1
PH0-OSC-IN
  Top 0.203: U1.12 30.62,37.33 29.34,38.61 28.45,38.61 | Y1.2 27.36,38.61 28.45,38.61 | C6.1 29.46,39.62 28.45,38.61
PH1-OSC-OUT
  Top 0.203: R7.1 33.15,36.32 33.66,36.83 U1.13
SWCLK  (via drill 0.35)
  Top 0.203: U1.76 48.67,45.75 49.09,46.16 49.15,46.23 v49.66,46.23 | J2.6 28.32,12.95 28.58,12.7 30.48,12.7 30.86,12.32 J2.9 30.86,8 31.37,7.49 59.44,7.49 60.71,8.76 v60.78,8.69
  Bottom 0.203: v49.66,46.23 43.06,46.23 42.43,45.6 41.9,45.6 41.53,45.97 41.53,46.61 42.91,47.98 59.47,47.98 60.96,46.49 60.96,8.88 v60.78,8.69
SWDIO  (via drill 0.35)
  Top 0.203: J2.4 27.05,17.78 28.32,19.05 v29.34,19.05 | v52.32,41.27 50.58,41.27 U1.72
  Bottom 0.203: v29.34,19.05 50.29,19.05 54.99,23.75 54.99,39.88 53.59,41.27 v52.32,41.27
SWO  (via drill 0.35)
  Top 0.203: v42.16,46.23 v42.17,46.22 U1.89 | J2.8 29.59,17.65 v30.1,18.16
  Bottom 0.203: v30.1,18.16 50.55,18.16 55.88,23.5 55.88,46.86 55.12,47.62 43.05,47.62 42.16,46.74 v42.16,46.23
USART_RX  (via drill 0.35)
  Top 0.203: U1.87 43.17,53.09 40.64,55.63 J3.11 40.51,60.96 40.51,62.36 41.91,63.75 53.47,63.75 59.44,57.78 v59.44,47.12 | J2.13 33.4,8.64 33.78,8.25 59.05,8.25 v59.94,9.14 | 59.56,45.21 v59.44,45.21
  Bottom 0.203: v59.44,47.12 v59.44,45.21 60.07,44.58 60.07,9.27 v59.94,9.14
USART_TX  (via drill 0.35)
  Top 0.203: U1.86 43.67,57.29 43.18,57.78 J3.12 43.18,62.23 43.81,62.87 52.83,62.87 58.29,57.4 v58.29,47.12 | J2.14 33.4,13.08 33.78,12.7 34.92,12.7 35.69,11.94 35.69,9.4 36.07,9.02 v58.42,9.02
  Bottom 0.203: v58.29,47.12 v58.29,45.21 58.29,9.14 v58.42,9.02
VDDA
  Top 0.203: U1.22 33.47,32.33 32.51,31.37 32.51,31.11 | 32.51,31.11 32.51,29.29 C18.A | R8.2 32.51,31.11 | C18.A 32.59,28.93 C17.1 | C18.A 31.71,28.33 FB1.1
VREF_PLUS
  Top 0.203: U1.21 34.76,32.77 33.15,32.77 32.62,32.24 C19.1 31.1,32.24 30.81,31.95 R8.1 29.72,31.11 28.7,32.13 C20.A